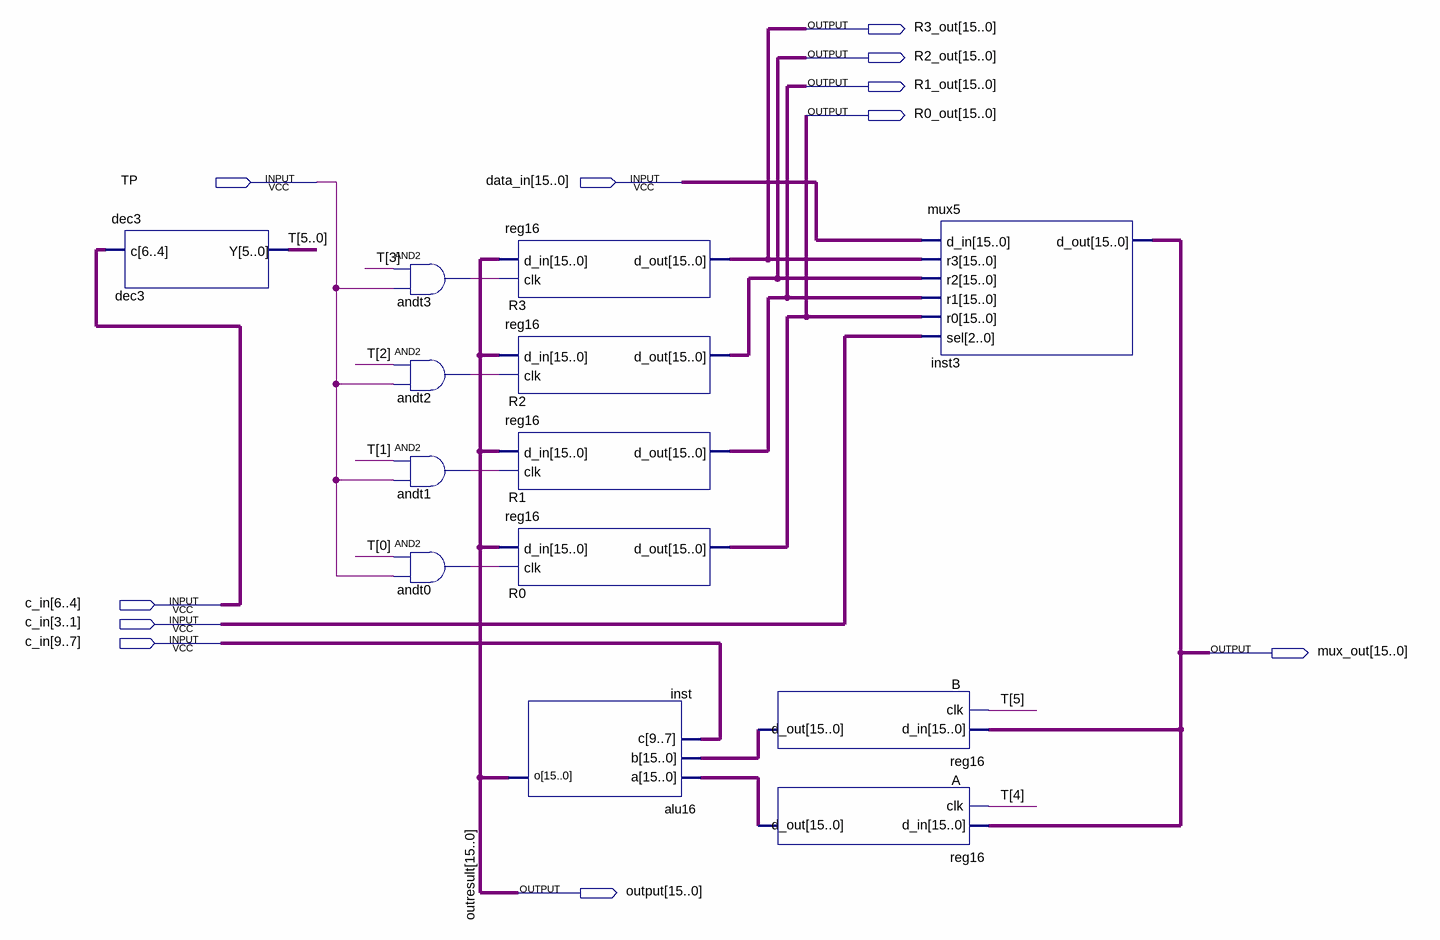
[diagram p0: schematic sheet]
// Quartus schematic up3_16.bdf as structural Verilog: 13 symbols, 11 pins
module up3_16 (
  input  TP,
  input  [15:0] data_in,
  input  [9:1] c_in,
  output [15:0] R3_out,
  output [15:0] R2_out,
  output [15:0] R1_out,
  output [15:0] R0_out,
  output [15:0] mux_out,
  output [15:0] \output 
);

  wire andt0_out, andt1_out, andt2_out, andt3_out;
  wire [5:0] T;
  wire [15:0] A_d_out, B_d_out;

  dec3 dec3 (.c(c_in[6:4]), .Y(T));
  and andt3 (andt3_out, T[3], TP);
  and andt2 (andt2_out, T[2], TP);
  and andt1 (andt1_out, T[1], TP);
  and andt0 (andt0_out, T[0], TP);
  reg16 R3 (.d_in(\output ), .clk(andt3_out), .d_out(R3_out));
  reg16 R2 (.d_in(\output ), .clk(andt2_out), .d_out(R2_out));
  reg16 R1 (.d_in(\output ), .clk(andt1_out), .d_out(R1_out));
  reg16 R0 (.d_in(\output ), .clk(andt0_out), .d_out(R0_out));
  alu16 inst (.a(A_d_out), .b(B_d_out), .c(c_in[9:7]), .o(\output ));
  reg16 B (.d_in(mux_out), .clk(T[5]), .d_out(B_d_out));
  reg16 A (.d_in(mux_out), .clk(T[4]), .d_out(A_d_out));
  mux5 inst3 (.d_in(data_in), .r3(R3_out), .r2(R2_out), .r1(R1_out), .r0(R0_out), .sel(c_in[3:1]), .d_out(mux_out));

  // Other names for the same wires on the sheet: outresult[15:0] = \output 
endmodule
